# Altium project cw312_sam4s.PrjPcb
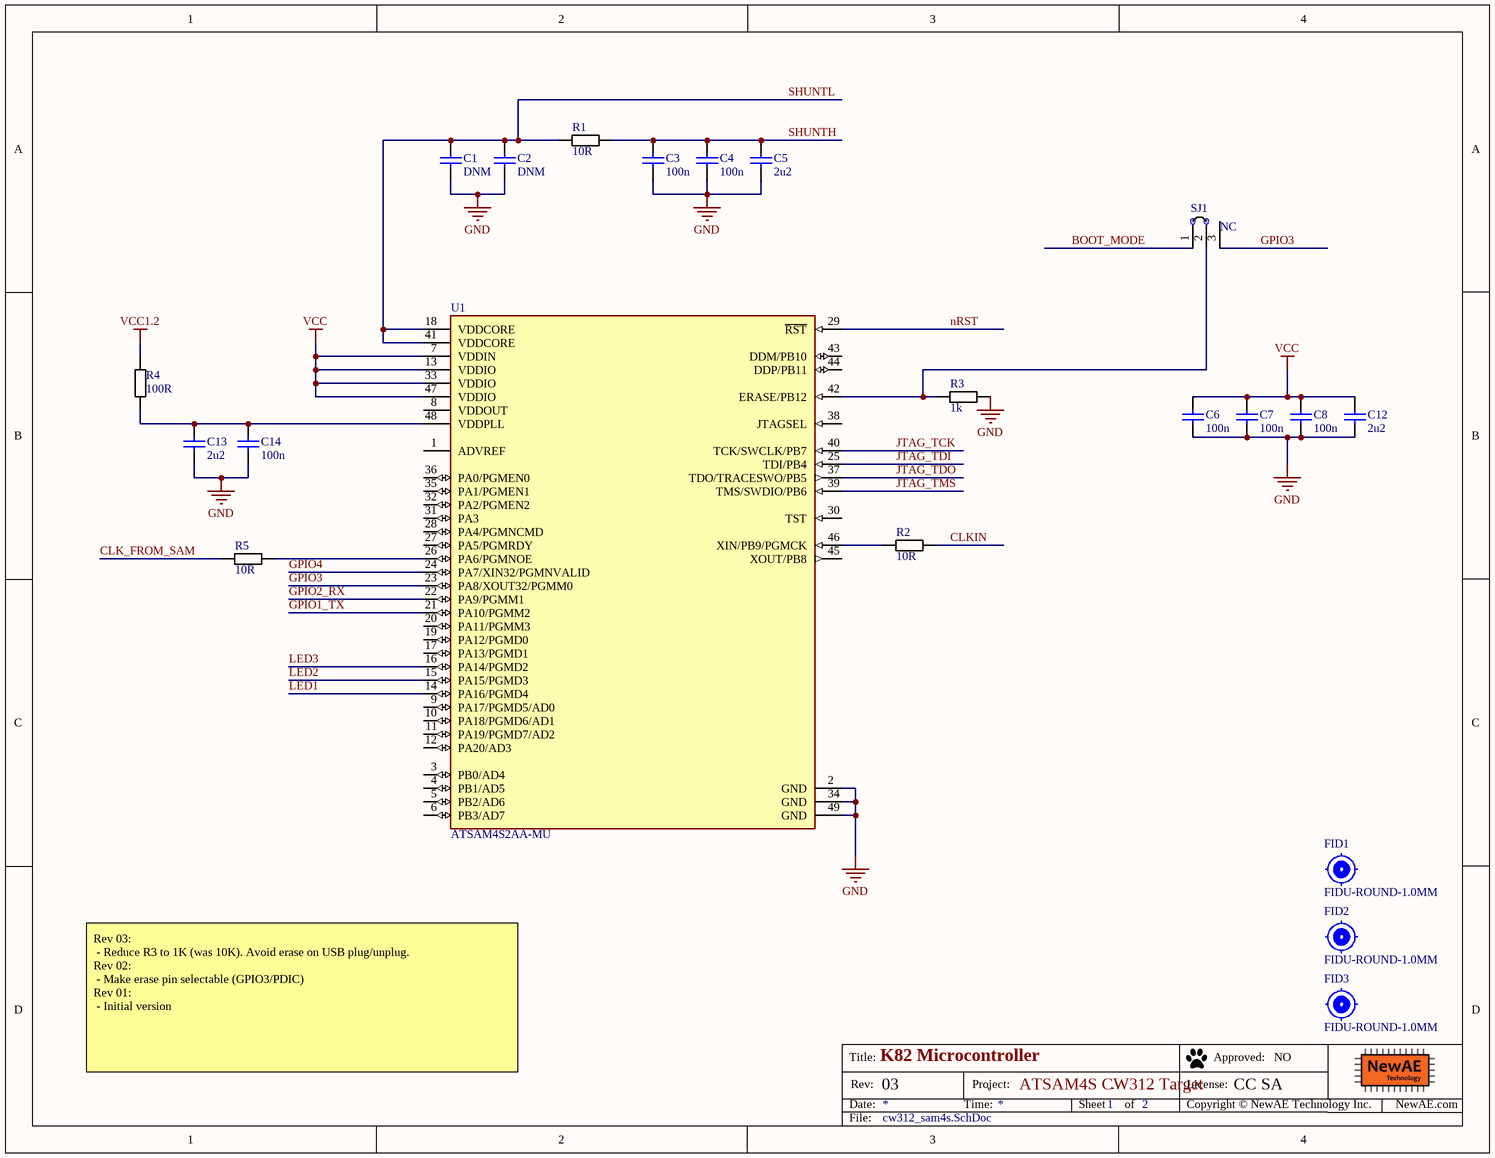
[diagram p0: cw312_sam4s.SchDoc]
PrjLicense: CC SA; PrjName: ATSAM4S CW312 Target; PrjRev: 03
2 sheets, 24 parts. Net scope: global (net labels, ports and power ports of the same name join across sheets).
Board file: cw312_sam4s.PcbDoc
Sheets:
  cw312_sam4s.SchDoc
  cw312_sam4s_cardedge.SchDoc

## Sheet cw312_sam4s.SchDoc: K82 Microcontroller
size Letter; Organization: NewAE Technology Inc.; Address1: 1083 Queen St., Suite 196; Address2: Halifax; Address3: NS; Address4: Canada B3H 0B2; DocumentNumber: .; Revision: .; SheetNumber: 1; SheetTotal: 2; SheetApproved: NO

### Parts
C1  DNM  [CAPC0603_M]
C2  DNM  [CAPC0603_M]
C3  100n  [CAPC0603_M]
C4  100n  [CAPC0603_M]
C5  2u2  [CAPC0603_M]
C6  100n  [CAPC0603_M]
C7  100n  [CAPC0603_M]
C8  100n  [CAPC0603_M]
C12  2u2  [CAPC0603_M]
C13  2u2  [CAPC0603_M]
C14  100n  [CAPC0603_M]
FID1  FIDU-ROUND-1.0MM  [FIDU-ROUND-1.0mm]  (no BOM)
FID2  FIDU-ROUND-1.0MM  [FIDU-ROUND-1.0mm]  (no BOM)
FID3  FIDU-ROUND-1.0MM  [FIDU-ROUND-1.0mm]  (no BOM)
R1  10R  [RESC1608X55N]
R2  10R  [RESC1608X55N]
R3  1k  [RESC1608X55N]
R4  100R  [RESC1608X55N]
R5  10R  [RESC1608X55N]
SJ1  NC  [SJ_3S_NC12]  (no BOM)
U1  ATSAM4S2AA-MU  [QFN50P700X700X100_HS-49M]

### Nets
GND: C1.2 C2.2 C3.2 C4.2 C5.2 C6.2 C7.2 C8.2 C12.2 C13.2 C14.2 R3.2 U1.2(GND) U1.34(GND) U1.49(GND)
VCC: C6.1 C7.1 C8.1 C12.1 U1.7(VDDIN) U1.13(VDDIO) U1.33(VDDIO) U1.47(VDDIO)  [project net IOVREF]
VCC1.2: R4.1  [project net FILTIN]
BOOT_MODE: SJ1.1
CLK_FROM_SAM: R5.2
CLKIN: R2.1
GPIO1_TX: U1.21(PA10/PGMM2)
GPIO2_RX: U1.22(PA9/PGMM1)
GPIO3: SJ1.3 U1.23(PA8/XOUT32/PGMM0)
GPIO4: U1.24(PA7/XIN32/PGMNVALID)
JTAG_TCK: U1.40(TCK/SWCLK/PB7)
JTAG_TDI: U1.25(TDI/PB4)
JTAG_TDO: U1.37(TDO/TRACESWO/PB5)
JTAG_TMS: U1.39(TMS/SWDIO/PB6)
LED1: U1.14(PA16/PGMD4)
LED2: U1.15(PA15/PGMD3)
LED3: U1.16(PA14/PGMD2)
nRST: U1.29(~{RST})
SHUNTH: C3.1 C4.1 C5.1 R1.2  [project net FILT_HP]
SHUNTL: C1.1 C2.1 R1.1 U1.18(VDDCORE) U1.41(VDDCORE)
NetC13_1: C13.1 C14.1 R4.2 U1.48(VDDPLL)
NetR2_2: R2.2 U1.46(XIN/PB9/PGMCK)
NetR3_1: R3.1 SJ1.2 U1.42(ERASE/PB12)
NetR5_1: R5.1 U1.26(PA6/PGMNOE)

Not connected (* = marked no-connect by the designer): U1 1(ADVREF) 3(PB0/AD4) 4(PB1/AD5) 5(PB2/AD6) 6(PB3/AD7) 8(VDDOUT) 9(PA17/PGMD5/AD0) 10(PA18/PGMD6/AD1) 11(PA19/PGMD7/AD2) 12(PA20/AD3) 17(PA13/PGMD1) 19(PA12/PGMD0) 20(PA11/PGMM3) 27(PA5/PGMRDY) 28(PA4/PGMNCMD) 30(TST) 31(PA3) 32(PA2/PGMEN2) 35(PA1/PGMEN1) 36(PA0/PGMEN0) 38(JTAGSEL) 43(DDM/PB10) 44(DDP/PB11) 45(XOUT/PB8)

### Notes on the sheet
- Rev 03:
  - Reduce R3 to 1K (was 10K). Avoid erase on USB plug/unplug.
  Rev 02:
  - Make erase pin selectable (GPIO3/PDIC)
  Rev 01:
  - Initial version
- Title:
- Date:
- Rev:
- Time:
- Project:
- Sheet
- of
- License:
- Copyright © NewAE Technology Inc.
- Approved:
- NewAE.com
- File:

### Library data of the parts
C1 C2 = CCHIP-100n-0603: Manufacture 1: Kemet; Manufacture Part Number 1: C0603C104K5RACTU; Component Group: Capacitor; Value: 100n; Case-EIA: 0603; Case-Metric: 1608; Rated Voltage: 50VDC; Part Number: CCHIP-100n-0603; Footprint: 0603; Pin Count: 2; Supplier 1: Digi-Key; Supplier Part Number 1: 399-5089-2-ND; Mounting Technology: SMT; Component Kind: Standard; Component Type: Standard
C3 C4 C6-C8 C14 = CCHIP-100n-0603: 100n, 0603; Manufacture 1: Kemet; Manufacture Part Number 1: C0603C104K5RACTU; Component Group: Capacitor; Case-EIA: 0603; Case-Metric: 1608; Rated Voltage: 50VDC; Part Number: CCHIP-100n-0603; Footprint: 0603; Pin Count: 2; Supplier 1: Digi-Key; Supplier Part Number 1: 399-5089-2-ND; Value: 100n; Mounting Technology: SMT; Component Kind: Standard; Component Type: Standard
C5 C12 C13 = CCHIP-2u2-0603: 2u2, 0603; Manufacture 1: Samsung; Manufacture Part Number 1: CL10B225KP8NNNC; Component Group: Capacitor; Case-EIA: 0603; Case-Metric: 1608; Rated Voltage: 10VDC; Part Number: CCHIP-2u2-0603; Footprint: 0603; Pin Count: 2; Supplier 1: Digi-Key; Supplier Part Number 1: 1276-1134-2-ND; Value: 2u2; Mounting Technology: SMT; Component Kind: Standard; Component Type: Standard
FID1-FID3 = FIDU-ROUND-1.0MM: ROUND FIDUCIAL; Component Group: PCB Feature; Part Number: FIDU-ROUND-1.0MM; Pin Count: 0; Component Type: Standard (No BOM)
R1 R2 R5 = RCHIP-10R-0603: 10R res, 0603, 1%, 1/10W; Manufacture 1: Yageo; Manufacture Part Number 1: RC0603FR-0710RL; Component Group: Resistor; Case-EIA: 0603; Case-Metric: 1608; Rated Power: 0.1W; Rated Voltage: 75VDC; Part Number: RCHIP-10R-0603; Footprint: 0603; Pin Count: 2; Supplier 1: Digi-Key; Supplier Part Number 1: 311-10.0HRCT-ND; Value: 10R; Tolerance: 1%; Mounting Technology: SMT; Temperature Range: -55C to 155C; Component Kind: Standard; Component Type: Standard
R3 = RCHIP-1K-0603: 1k res, 0603, 1%, 1/10W; Manufacture 1: Yageo; Manufacture Part Number 1: RC0603FR-071KL; Component Group: Resistor; Case-EIA: 0603; Case-Metric: 1608; Rated Power: 0.1W; Rated Voltage: 75VDC; Part Number: RCHIP-1K-0603; Footprint: 0603; Pin Count: 2; Supplier 1: Digi-Key; Supplier Part Number 1: 311-1.00KHRCT-ND; Value: 1k; Tolerance: 1%; Mounting Technology: SMT; Temperature Range: -55C to 155C; Component Kind: Standard; Component Type: Standard
R4 = RCHIP-100R-0603: 100R res, 0603, 1%, 1/10W; Manufacture 1: Yageo; Manufacture Part Number 1: RC0603FR-07100RL; Component Group: Resistor; Case-EIA: 0603; Case-Metric: 1608; Rated Power: 0.1W; Rated Voltage: 75VDC; Part Number: RCHIP-100R-0603; Footprint: 0603; Pin Count: 2; Supplier 1: Digi-Key; Supplier Part Number 1: 311-100HRCT-ND; Value: 100R; Tolerance: 1%; Mounting Technology: SMT; Temperature Range: -55C to 155C; Component Kind: Standard; Component Type: Standard
SJ1 = SJ_3S_12JMP: Solder Jumper, NC; Component Group: PCB Feature; Part Number: SJ_3S_12JMP; Pin Count: 3; Mounting Technology: COPPER; Component Type: Standard (No BOM)
U1 = ATSAM4S2AA-MU: ATSAM4S, 128KB FLASH, 48QFN; Manufacture 1: Microchip; Peripherals: Brown-out Detect/Reset; Number of I/Os: 34; Core Architecture: ARM; Frequency: 120MHz; Oscillator Type: Internal; Component Group: Digital IC; PP Material Stack: 0; Number of Pins: 48; Memory Size: 128KB; Max Operating Temperature: 85°C; Memory Type: FLASH; Packaging: Tray; Min Operating Temperature: -40°C; Case/Package: QFN; Part Number: ATSAM4S2AA-MU; Manufacture Part Number 1: ATSAM4S2AA-MU; Pin Count: 49; Supplier 1: Digi-Key; Mounting Technology: SMT; Component Kind: Standard; Component Type: Standard; PP Rotation: 0; PP Rotation1: 0

## Sheet cw312_sam4s_cardedge.SchDoc: CW312 Connections
size Letter; Organization: NewAE Technology Inc.; Address1: 1083 Queen St., Suite 196; Address2: Halifax; Address3: NS; Address4: Canada B3H 0B2; DocumentNumber: .; Revision: .; SheetNumber: 1; SheetTotal: 2; SheetApproved: YES
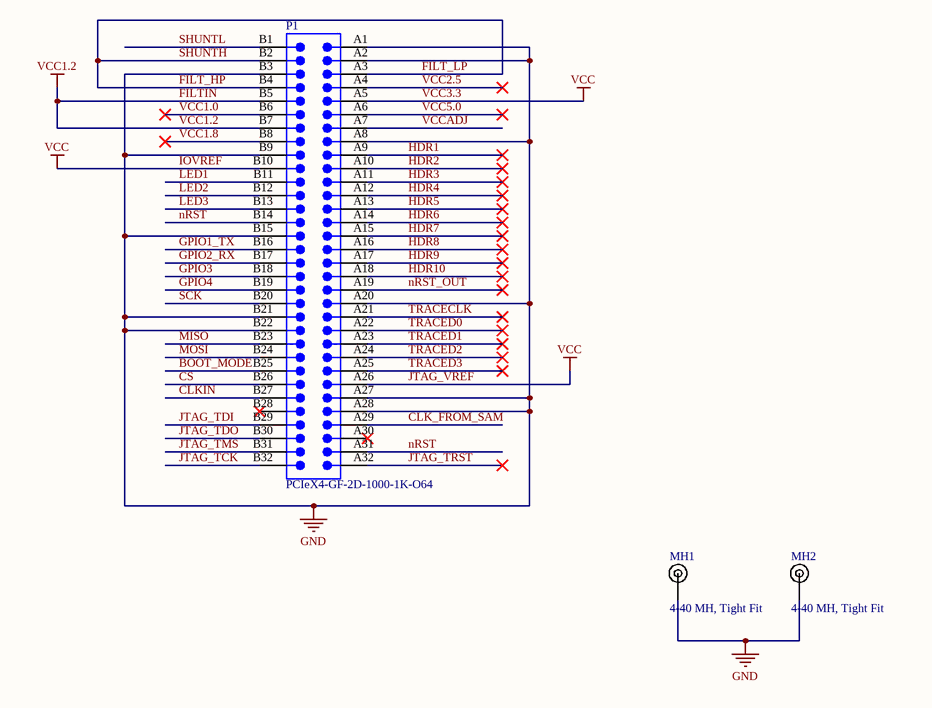
[diagram p1: cw312_sam4s_cardedge.SchDoc]

### Parts
MH1  4-40 MH, Tight Fit  [MOUNT_#4_TIGHT]
MH2  4-40 MH, Tight Fit  [MOUNT_#4_TIGHT]
P1  PCIeX4-GF-2D-1000-1K-O64  [PCIeX4-GF-2D-1000-1K-O64]  (no BOM)

### Nets
FILTIN: P1.B5 P1.B7  [also labelled VCC1.2]
GND: MH1.1 MH2.1 P1.A1 P1.A2 P1.A8 P1.A20 P1.A27 P1.A28 P1.B3 P1.B9 P1.B15 P1.B21 P1.B22
IOVREF: P1.A5 P1.A26 P1.B10  [also labelled JTAG_VREF, VCC, VCC3.3]
BOOT_MODE: P1.B25
CLK_FROM_SAM: P1.A29
CLKIN: P1.B27
CS: P1.B26
FILT_HP: P1.A3 P1.B2 P1.B4  [also labelled FILT_LP, SHUNTH]
GPIO1_TX: P1.B16
GPIO2_RX: P1.B17
GPIO3: P1.B18
GPIO4: P1.B19
HDR1: P1.A9
HDR2: P1.A10
HDR3: P1.A11
HDR4: P1.A12
HDR5: P1.A13
HDR6: P1.A14
HDR7: P1.A15
HDR8: P1.A16
HDR9: P1.A17
HDR10: P1.A18
JTAG_TCK: P1.B32
JTAG_TDI: P1.B29
JTAG_TDO: P1.B30
JTAG_TMS: P1.B31
JTAG_TRST: P1.A32
LED1: P1.B11
LED2: P1.B12
LED3: P1.B13
MISO: P1.B23
MOSI: P1.B24
nRST: P1.A31 P1.B14
nRST_OUT: P1.A19
SCK: P1.B20
SHUNTL: P1.B1
TRACECLK: P1.A21
TRACED0: P1.A22
TRACED1: P1.A23
TRACED2: P1.A24
TRACED3: P1.A25
VCC1.0: P1.B6
VCC1.8: P1.B8
VCC2.5: P1.A4
VCC5.0: P1.A6
VCCADJ: P1.A7

Not connected (* = marked no-connect by the designer): P1 A30* B28*

### Notes on the sheet
- Title:
- Date:
- Rev:
- Time:
- Project:
- Sheet
- of
- License:
- Copyright © NewAE Technology Inc.
- Approved:
- NewAE.com
- File:

### Library data of the parts
MH1 MH2 = MOUNT_#4_TIGHT: Machine screw 4-40 Mounting Hole; Component Group: Mechanical; PP Material Stack: 0; Part Number: MOUNT_#4_TIGHT; Pin Count: 1; Component Kind: Mechanical; Component Type: Mechanical; PP Rotation: 0
P1 = CMP-0001-00031-2: Golden finger, PCIeX4, Dual, Opposite, Pitch 1mm, 64-Position; Mating Connector: Molex-87715-9106; Publisher: Altium; ClassName: Edge Connector; Datasheet Version: rev2.0, Apr-2007; Package Reference: PCIeX4-GF-2D-1000-1K-O64

## Nets that join several sheets
FILTIN: cw312_sam4s (R4.1), cw312_sam4s_cardedge (P1.B5 P1.B7)
GND: cw312_sam4s (15 pins), cw312_sam4s_cardedge (13 pins)
IOVREF: cw312_sam4s (8 pins), cw312_sam4s_cardedge (P1.A5 P1.A26 P1.B10)
BOOT_MODE: cw312_sam4s (SJ1.1), cw312_sam4s_cardedge (P1.B25)
CLK_FROM_SAM: cw312_sam4s (R5.2), cw312_sam4s_cardedge (P1.A29)
CLKIN: cw312_sam4s (R2.1), cw312_sam4s_cardedge (P1.B27)
FILT_HP: cw312_sam4s (C3.1 C4.1 C5.1 R1.2), cw312_sam4s_cardedge (P1.A3 P1.B2 P1.B4)
GPIO1_TX: cw312_sam4s (U1.21), cw312_sam4s_cardedge (P1.B16)
GPIO2_RX: cw312_sam4s (U1.22), cw312_sam4s_cardedge (P1.B17)
GPIO3: cw312_sam4s (SJ1.3 U1.23), cw312_sam4s_cardedge (P1.B18)
GPIO4: cw312_sam4s (U1.24), cw312_sam4s_cardedge (P1.B19)
JTAG_TCK: cw312_sam4s (U1.40), cw312_sam4s_cardedge (P1.B32)
JTAG_TDI: cw312_sam4s (U1.25), cw312_sam4s_cardedge (P1.B29)
JTAG_TDO: cw312_sam4s (U1.37), cw312_sam4s_cardedge (P1.B30)
JTAG_TMS: cw312_sam4s (U1.39), cw312_sam4s_cardedge (P1.B31)
LED1: cw312_sam4s (U1.14), cw312_sam4s_cardedge (P1.B11)
LED2: cw312_sam4s (U1.15), cw312_sam4s_cardedge (P1.B12)
LED3: cw312_sam4s (U1.16), cw312_sam4s_cardedge (P1.B13)
nRST: cw312_sam4s (U1.29), cw312_sam4s_cardedge (P1.A31 P1.B14)
SHUNTL: cw312_sam4s (5 pins), cw312_sam4s_cardedge (P1.B1)